# EAGLE design snowflake-hw-v0.0.1 (EAGLE 9.6.2)
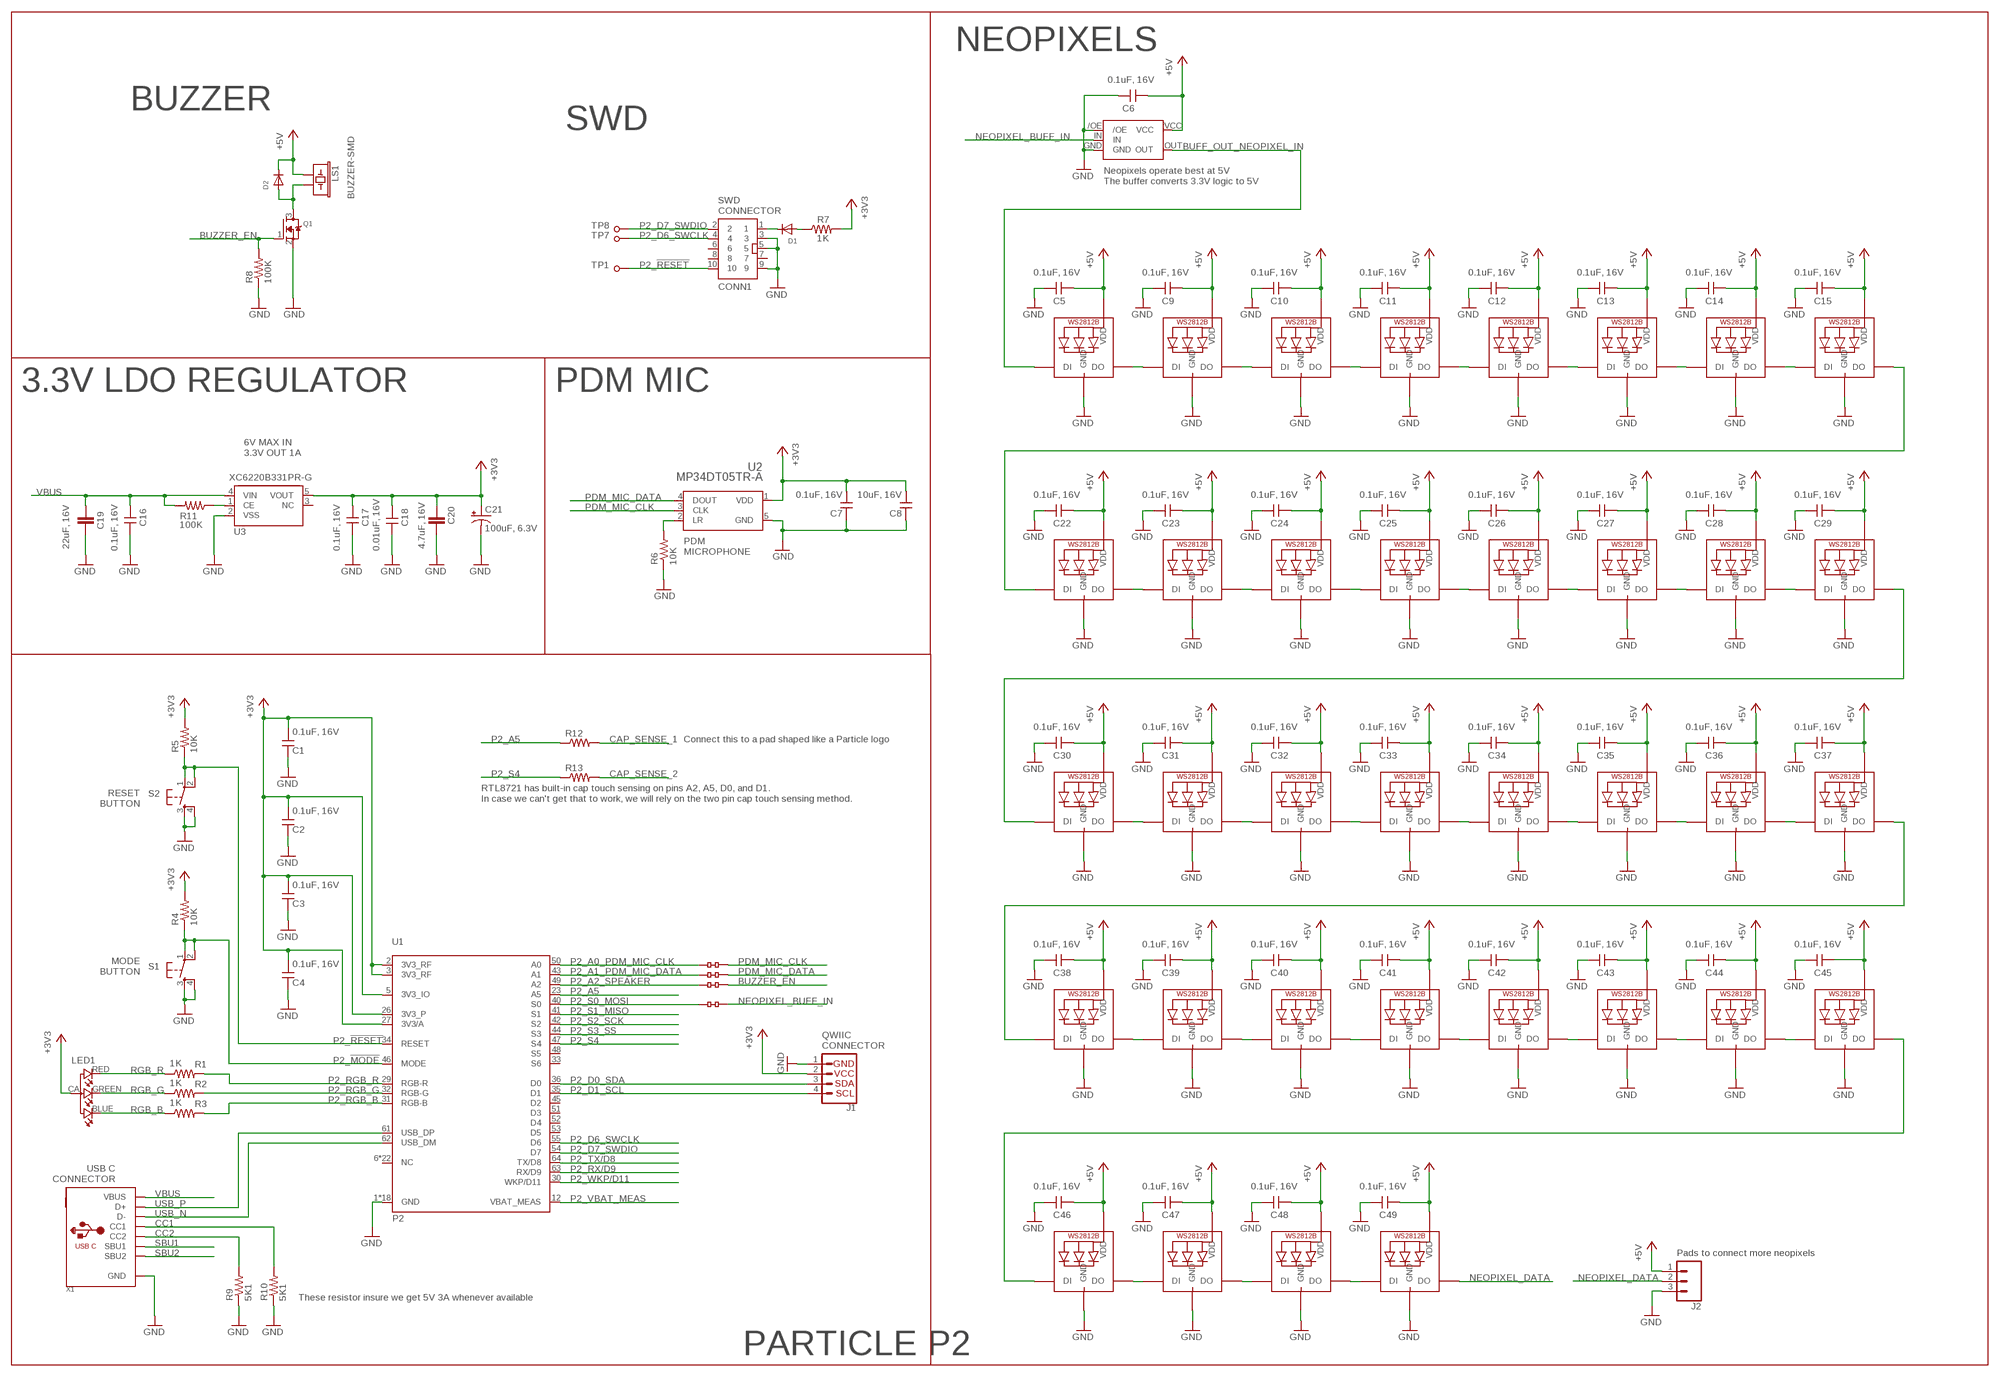
[diagram p0: schematic, sheet 1]

## Parts
C1  0.1uF, 16V  CAP_0.1UF_16V_0603  [C0603_P]
C2  0.1uF, 16V  CAP_0.1UF_16V_0603  [C0603_P]
C3  0.1uF, 16V  CAP_0.1UF_16V_0603  [C0603_P]
C4  0.1uF, 16V  CAP_0.1UF_16V_0603  [C0603_P]
C5  0.1uF, 16V  CAP_0.1UF_16V_0603  [C0603_P]
C6  0.1uF, 16V  CAP_0.1UF_16V_0603  [C0603_P]
C7  0.1uF, 16V  CAP_0.1UF_16V_0603  [C0603_P]
C8  10uF, 16V  CAP_10UF_16V_0603  [C0603_P]
C9  0.1uF, 16V  CAP_0.1UF_16V_0603  [C0603_P]
C10  0.1uF, 16V  CAP_0.1UF_16V_0603  [C0603_P]
C11  0.1uF, 16V  CAP_0.1UF_16V_0603  [C0603_P]
C12  0.1uF, 16V  CAP_0.1UF_16V_0603  [C0603_P]
C13  0.1uF, 16V  CAP_0.1UF_16V_0603  [C0603_P]
C14  0.1uF, 16V  CAP_0.1UF_16V_0603  [C0603_P]
C15  0.1uF, 16V  CAP_0.1UF_16V_0603  [C0603_P]
C16  0.1uF, 16V  CAP_0.1UF_16V_0603  [C0603_P]
C17  0.1uF, 16V  CAP_0.1UF_16V_0603  [C0603_P]
C18  0.01uF, 16V  CAP_0.01UF_25V_0603  [C0603_P]
C19  22uF, 16V  C-EUC0805  [C0805]
C20  4.7uF, 16V  C-EUC0805  [C0805]
C21  100uF, 6.3V  CPOL-USC  [PANASONIC_C]
C22  0.1uF, 16V  CAP_0.1UF_16V_0603  [C0603_P]
C23  0.1uF, 16V  CAP_0.1UF_16V_0603  [C0603_P]
C24  0.1uF, 16V  CAP_0.1UF_16V_0603  [C0603_P]
C25  0.1uF, 16V  CAP_0.1UF_16V_0603  [C0603_P]
C26  0.1uF, 16V  CAP_0.1UF_16V_0603  [C0603_P]
C27  0.1uF, 16V  CAP_0.1UF_16V_0603  [C0603_P]
C28  0.1uF, 16V  CAP_0.1UF_16V_0603  [C0603_P]
C29  0.1uF, 16V  CAP_0.1UF_16V_0603  [C0603_P]
C30  0.1uF, 16V  CAP_0.1UF_16V_0603  [C0603_P]
C31  0.1uF, 16V  CAP_0.1UF_16V_0603  [C0603_P]
C32  0.1uF, 16V  CAP_0.1UF_16V_0603  [C0603_P]
C33  0.1uF, 16V  CAP_0.1UF_16V_0603  [C0603_P]
C34  0.1uF, 16V  CAP_0.1UF_16V_0603  [C0603_P]
C35  0.1uF, 16V  CAP_0.1UF_16V_0603  [C0603_P]
C36  0.1uF, 16V  CAP_0.1UF_16V_0603  [C0603_P]
C37  0.1uF, 16V  CAP_0.1UF_16V_0603  [C0603_P]
C38  0.1uF, 16V  CAP_0.1UF_16V_0603  [C0603_P]
C39  0.1uF, 16V  CAP_0.1UF_16V_0603  [C0603_P]
C40  0.1uF, 16V  CAP_0.1UF_16V_0603  [C0603_P]
C41  0.1uF, 16V  CAP_0.1UF_16V_0603  [C0603_P]
C42  0.1uF, 16V  CAP_0.1UF_16V_0603  [C0603_P]
C43  0.1uF, 16V  CAP_0.1UF_16V_0603  [C0603_P]
C44  0.1uF, 16V  CAP_0.1UF_16V_0603  [C0603_P]
C45  0.1uF, 16V  CAP_0.1UF_16V_0603  [C0603_P]
C46  0.1uF, 16V  CAP_0.1UF_16V_0603  [C0603_P]
C47  0.1uF, 16V  CAP_0.1UF_16V_0603  [C0603_P]
C48  0.1uF, 16V  CAP_0.1UF_16V_0603  [C0603_P]
C49  0.1uF, 16V  CAP_0.1UF_16V_0603  [C0603_P]
CONN1  CONN5X2  [CONN5X2_1.27]
D1  DIODESOD-123  [SOD-123]
D2  DIODESOD-123  [SOD-123]
J1  QWIIC_CONNECTORJS-1MM  [1X04_1MM_RA]
J2  CONN_031X03_NO_SILK  [1X03_NO_SILK]
LED1  RGB-LED-CLMVB-FKARGB  [PLCC4-2MM-RGB]
LED2  WS2812B_SK6812E  [NEO3535_REVERSE]
LED3  WS2812B_SK6812E  [NEO3535_REVERSE]
LED4  WS2812B_SK6812E  [NEO3535_REVERSE]
LED5  WS2812B_SK6812E  [NEO3535_REVERSE]
LED6  WS2812B_SK6812E  [NEO3535_REVERSE]
LED7  WS2812B_SK6812E  [NEO3535_REVERSE]
LED8  WS2812B_SK6812E  [NEO3535_REVERSE]
LED9  WS2812B_SK6812E  [NEO3535_REVERSE]
LED10  WS2812B_SK6812E  [NEO3535_REVERSE]
LED11  WS2812B_SK6812E  [NEO3535_REVERSE]
LED12  WS2812B_SK6812E  [NEO3535_REVERSE]
LED13  WS2812B_SK6812E  [NEO3535_REVERSE]
LED14  WS2812B_SK6812E  [NEO3535_REVERSE]
LED15  WS2812B_SK6812E  [NEO3535_REVERSE]
LED16  WS2812B_SK6812E  [NEO3535_REVERSE]
LED17  WS2812B_SK6812E  [NEO3535_REVERSE]
LED18  WS2812B_SK6812E  [NEO3535_REVERSE]
LED19  WS2812B_SK6812E  [NEO3535_REVERSE]
LED20  WS2812B_SK6812E  [NEO3535_REVERSE]
LED21  WS2812B_SK6812E  [NEO3535_REVERSE]
LED22  WS2812B_SK6812E  [NEO3535_REVERSE]
LED23  WS2812B_SK6812E  [NEO3535_REVERSE]
LED24  WS2812B_SK6812E  [NEO3535_REVERSE]
LED25  WS2812B_SK6812E  [NEO3535_REVERSE]
LED26  WS2812B_SK6812E  [NEO3535_REVERSE]
LED27  WS2812B_SK6812E  [NEO3535_REVERSE]
LED28  WS2812B_SK6812E  [NEO3535_REVERSE]
LED29  WS2812B_SK6812E  [NEO3535_REVERSE]
LED30  WS2812B_SK6812E  [NEO3535_REVERSE]
LED31  WS2812B_SK6812E  [NEO3535_REVERSE]
LED32  WS2812B_SK6812E  [NEO3535_REVERSE]
LED33  WS2812B_SK6812E  [NEO3535_REVERSE]
LED34  WS2812B_SK6812E  [NEO3535_REVERSE]
LED35  WS2812B_SK6812E  [NEO3535_REVERSE]
LED36  WS2812B_SK6812E  [NEO3535_REVERSE]
LED37  WS2812B_SK6812E  [NEO3535_REVERSE]
LS1  BUZZER-SMD  [BUZZER-CCV]
Q1  MOSFET-NREFLOW  [SOT23]
R1  1K  RES_1K_0603  [R0603_P]
R2  1K  RES_1K_0603  [R0603_P]
R3  1K  RES_1K_0603  [R0603_P]
R4  10K  RES_10K_0603  [R0603_P]
R5  10K  RES_10K_0603  [R0603_P]
R6  10K  RES_10K_0603  [R0603_P]
R7  1K  RES_1K_0603  [R0603_P]
R8  100K  RES_100K_0603  [R0603_P]
R9  5K1  RES_0603  [R0603_P]
R10  5K1  RES_0603  [R0603_P]
R11  100K  RES_100K_0603  [R0603_P]
R12  RES_0603  [R0603_P]
R13  RES_0603  [R0603_P]
S1  TAC_SWITCHSMD  [TACTILE_SWITCH_SMD]
S2  TAC_SWITCHSMD  [TACTILE_SWITCH_SMD]
TP1  TP-1.5MM  [TP]
TP7  TP-1.5MM  [TP]
TP8  TP-1.5MM  [TP]
U1  P2  [P2]
U2  MP34DT05TR-A  [MP34DT05TR-A_STM]
U3  XC6220B331PR-G  XC6220B331PR-GSOT-89-5_TOR-M  [SOT-89-5_TOR-M]
U$1  NL17SZ125SOT553  [SOT-553]
U$2  JMP_0603_NC  [JMP_0603_NC]
U$3  JMP_0603_NC  [JMP_0603_NC]
U$4  JMP_0603_NC  [JMP_0603_NC]
U$15  JMP_0603_NC  [JMP_0603_NC]
X1  USB_C  [USB_C_CUSB31-CFM2AX-01-X]

## Nets
+3V3: C1.1 C2.1 C3.1 C4.1 C7.1 C8.1 C17.2 C18.1 C20.1 C21.+ J1.2(VCC) LED1.CA R4.2 R5.2 R7.2 U1.2(3V3_RF) U1.3(3V3_RF) U1.5(3V3_IO) U1.26(3V3_P) U1.27(3V3/A) U2.1(VDD) U3.5(VOUT)
+5V: C5.2 C6.2 C9.2 C10.2 C11.2 C12.2 C13.2 C14.2 C15.2 C22.2 C23.2 C24.2 C25.2 C26.2 C27.2 C28.2 C29.2 C30.2 C31.2 C32.2 C33.2 C34.2 C35.2 C36.2 C37.2 C38.2 C39.2 C40.2 C41.2 C42.2 C43.2 C44.2 C45.2 C46.2 C47.2 C48.2 C49.2 D2.C J2.1 LED2.1-VDD(VDD) LED3.1-VDD(VDD) LED4.1-VDD(VDD) LED5.1-VDD(VDD) LED6.1-VDD(VDD) LED7.1-VDD(VDD) LED8.1-VDD(VDD) LED9.1-VDD(VDD) LED10.1-VDD(VDD) LED11.1-VDD(VDD) LED12.1-VDD(VDD) LED13.1-VDD(VDD) LED14.1-VDD(VDD) LED15.1-VDD(VDD) LED16.1-VDD(VDD) LED17.1-VDD(VDD) LED18.1-VDD(VDD) LED19.1-VDD(VDD) LED20.1-VDD(VDD) LED21.1-VDD(VDD) LED22.1-VDD(VDD) LED23.1-VDD(VDD) LED24.1-VDD(VDD) LED25.1-VDD(VDD) LED26.1-VDD(VDD) LED27.1-VDD(VDD) LED28.1-VDD(VDD) LED29.1-VDD(VDD) LED30.1-VDD(VDD) LED31.1-VDD(VDD) LED32.1-VDD(VDD) LED33.1-VDD(VDD) LED34.1-VDD(VDD) LED35.1-VDD(VDD) LED36.1-VDD(VDD) LED37.1-VDD(VDD) LS1.+ U$1.VCC
BUFF_OUT_NEOPIXEL_IN: LED2.4-DIN(DI) U$1.OUT
BUZZER_EN: Q1.1(G) R8.2 U$2.2
CAP_SENSE_1: R12.2
CAP_SENSE_2: R13.2
CC1: R10.2 X1.A5(CC1)
CC2: R9.2 X1.B5(CC2)
GND: C1.2 C2.2 C3.2 C4.2 C5.1 C6.1 C7.2 C8.2 C9.1 C10.1 C11.1 C12.1 C13.1 C14.1 C15.1 C16.1 C17.1 C18.2 C19.2 C20.2 C21.- C22.1 C23.1 C24.1 C25.1 C26.1 C27.1 C28.1 C29.1 C30.1 C31.1 C32.1 C33.1 C34.1 C35.1 C36.1 C37.1 C38.1 C39.1 C40.1 C41.1 C42.1 C43.1 C44.1 C45.1 C46.1 C47.1 C48.1 C49.1 CONN1.3 CONN1.5 CONN1.9 J1.1(GND) J2.3 LED2.3-GND(GND) LED3.3-GND(GND) LED4.3-GND(GND) LED5.3-GND(GND) LED6.3-GND(GND) LED7.3-GND(GND) LED8.3-GND(GND) LED9.3-GND(GND) LED10.3-GND(GND) LED11.3-GND(GND) LED12.3-GND(GND) LED13.3-GND(GND) LED14.3-GND(GND) LED15.3-GND(GND) LED16.3-GND(GND) LED17.3-GND(GND) LED18.3-GND(GND) LED19.3-GND(GND) LED20.3-GND(GND) LED21.3-GND(GND) LED22.3-GND(GND) LED23.3-GND(GND) LED24.3-GND(GND) LED25.3-GND(GND) LED26.3-GND(GND) LED27.3-GND(GND) LED28.3-GND(GND) LED29.3-GND(GND) LED30.3-GND(GND) LED31.3-GND(GND) LED32.3-GND(GND) LED33.3-GND(GND) LED34.3-GND(GND) LED35.3-GND(GND) LED36.3-GND(GND) LED37.3-GND(GND) Q1.2(S) R6.1 R8.1 R9.1 R10.1 S1.3 S1.4 S2.3 S2.4 U1.1(GND) U1.4(GND) U1.13(GND) U1.15(GND) U1.25(GND) U1.28(GND) U1.37(GND) U1.39(GND) U1.59(GND) U1.65(GND) U1.66(GND) U1.67(GND) U1.68(GND) U1.69(GND) U1.70(GND) U1.71(GND) U1.72(GND) U1.73(GND) U2.5(GND) U3.2(VSS) U$1./OE U$1.GND X1.A1B12(GND) X1.B1A12(GND)
N$1: R6.2 U2.2(LR)
N$2: LED2.2-DOUT(DO) LED3.4-DIN(DI)
N$3: LED3.2-DOUT(DO) LED4.4-DIN(DI)
N$4: LED4.2-DOUT(DO) LED5.4-DIN(DI)
N$5: LED5.2-DOUT(DO) LED6.4-DIN(DI)
N$6: LED6.2-DOUT(DO) LED7.4-DIN(DI)
N$7: LED7.2-DOUT(DO) LED8.4-DIN(DI)
N$8: LED8.2-DOUT(DO) LED9.4-DIN(DI)
N$9: D2.A LS1.- Q1.3(D)
N$10: R11.1 U3.1(CE)
N$11: LED10.2-DOUT(DO) LED11.4-DIN(DI)
N$12: LED11.2-DOUT(DO) LED12.4-DIN(DI)
N$13: LED12.2-DOUT(DO) LED13.4-DIN(DI)
N$14: LED13.2-DOUT(DO) LED14.4-DIN(DI)
N$15: LED14.2-DOUT(DO) LED15.4-DIN(DI)
N$16: LED15.2-DOUT(DO) LED16.4-DIN(DI)
N$17: CONN1.1 D1.C
N$18: D1.A R7.1
N$19: LED16.2-DOUT(DO) LED17.4-DIN(DI)
N$20: LED9.2-DOUT(DO) LED10.4-DIN(DI)
N$21: LED24.2-DOUT(DO) LED25.4-DIN(DI)
N$22: LED23.2-DOUT(DO) LED24.4-DIN(DI)
N$23: LED22.2-DOUT(DO) LED23.4-DIN(DI)
N$24: LED21.2-DOUT(DO) LED22.4-DIN(DI)
N$25: LED20.2-DOUT(DO) LED21.4-DIN(DI)
N$26: LED19.2-DOUT(DO) LED20.4-DIN(DI)
N$27: LED18.2-DOUT(DO) LED19.4-DIN(DI)
N$28: LED25.2-DOUT(DO) LED26.4-DIN(DI)
N$29: LED26.2-DOUT(DO) LED27.4-DIN(DI)
N$30: LED27.2-DOUT(DO) LED28.4-DIN(DI)
N$31: LED28.2-DOUT(DO) LED29.4-DIN(DI)
N$32: LED29.2-DOUT(DO) LED30.4-DIN(DI)
N$33: LED30.2-DOUT(DO) LED31.4-DIN(DI)
N$34: LED31.2-DOUT(DO) LED32.4-DIN(DI)
N$35: LED32.2-DOUT(DO) LED33.4-DIN(DI)
N$36: LED17.2-DOUT(DO) LED18.4-DIN(DI)
N$37: LED34.2-DOUT(DO) LED35.4-DIN(DI)
N$38: LED35.2-DOUT(DO) LED36.4-DIN(DI)
N$39: LED36.2-DOUT(DO) LED37.4-DIN(DI)
N$40: LED33.2-DOUT(DO) LED34.4-DIN(DI)
NEOPIXEL_BUFF_IN: U$1.IN U$15.2
NEOPIXEL_DATA: J2.2 LED37.2-DOUT(DO)
P2_!MODE: R4.1 S1.1 S1.2 U1.46(MODE)
P2_!RESET: CONN1.10 R5.1 S2.1 S2.2 TP1.TP U1.34(RESET)
P2_A0_PDM_MIC_CLK: U1.50(A0) U$4.1
P2_A1_PDM_MIC_DATA: U1.43(A1) U$3.1
P2_A2_SPEAKER: U1.49(A2) U$2.1
P2_A5: R12.1 U1.23(A5)
P2_D0_SDA: J1.3(SDA) U1.36(D0)
P2_D1_SCL: J1.4(SCL) U1.35(D1)
P2_D6_SWCLK: CONN1.4 TP7.TP U1.55(D6)
P2_D7_SWDIO: CONN1.2 TP8.TP U1.54(D7)
P2_RGB_B: R3.2 U1.31(RGB-B)
P2_RGB_G: R2.2 U1.32(RGB-G)
P2_RGB_R: R1.2 U1.29(RGB-R)
P2_RX/D9: U1.63(RX/D9)
P2_S0_MOSI: U1.40(S0) U$15.1
P2_S1_MISO: U1.41(S1)
P2_S2_SCK: U1.42(S2)
P2_S3_SS: U1.44(S3)
P2_S4: R13.1 U1.47(S4)
P2_TX/D8: U1.64(TX/D8)
P2_VBAT_MEAS: U1.12(VBAT_MEAS)
P2_WKP/D11: U1.30(WKP/D11)
PDM_MIC_CLK: U2.3(CLK) U$4.2
PDM_MIC_DATA: U2.4(DOUT) U$3.2
RGB_B: LED1.BLUE R3.1
RGB_G: LED1.GREEN R2.1
RGB_R: LED1.RED R1.1
SBU1: X1.A8(SBU1)
SBU2: X1.B8(SBU2)
USB_N: U1.62(USB_DM) X1.A7(D-) X1.B7(D-)
USB_P: U1.61(USB_DP) X1.A6(D+) X1.B6(D+)
VBUS: C16.2 C19.1 R11.2 U3.4(VIN) X1.A4B9(VBUS) X1.B4A9(VBUS)
Unconnected: CONN1.6 CONN1.7 CONN1.8 U1.6(NC) U1.7(NC) U1.8(NC) U1.9(NC) U1.10(NC) U1.11(NC) U1.14(NC) U1.16(NC) U1.17(NC) U1.18(NC) U1.19(NC) U1.20(NC) U1.21(NC) U1.22(NC) U1.24(NC) U1.33(S6) U1.38(NC) U1.45(D2) U1.48(S5) U1.51(D3) U1.52(D4) U1.53(D5) U1.56(NC) U1.57(NC) U1.58(NC) U1.60(NC) U1.74(NC) U1.75(NC) U3.3(NC)

## Notes on the sheet
- NEOPIXELS
- BUZZER
- SWD
- Neopixels operate best at 5V
  The buffer converts 3.3V logic to 5V
- SWD
  CONNECTOR
- 3.3V LDO REGULATOR | PDM MIC
- 6V MAX IN
  3.3V OUT 1A
- PDM
  MICROPHONE
- Connect this to a pad shaped like a Particle logo
- RTL8721 has built-in cap touch sensing on pins A2, A5, D0, and D1. 
  In case we can't get that to work, we will rely on the two pin cap touch sensing method.
- RESET
  BUTTON
- MODE
  BUTTON
- QWIIC
  CONNECTOR
- USB C
  CONNECTOR
- Pads to connect more neopixels
- These resistor insure we get 5V 3A whenever available
- PARTICLE P2

## Library data of the parts
C1-C7 C9-C17 C22-C49 = particle-studios:CAP_: Particle Capacitors; DESP: CAP CER 0.1UF 16V X7R 0603; MFG: FENGHUA; MPN: 0603B104K160NT; PPN: PT-200082
C8 = particle-studios:CAP_: Particle Capacitors; DESP: CAP CER 10UF 16V X7R 0603; MFG: FENGHUA; MPN: 0603X106M160NT; PPN: PT-200139
C18 = particle-studios:CAP_: Particle Capacitors; DESP: CAP CER 0.01UF 16V X7R 0603; MFG: YAGEO; MPN: CC0603KRX7R9BB103; PPN: PT-200456
C19 C20 = rcl:C-EU: CAPACITOR, European symbol; SPICEPREFIX: C
C21 = rcl:CPOL-US: POLARIZED CAPACITOR, American symbol; SPICEPREFIX: C
CONN1 = particle-studios:CONN5X2: 5x2 pin JTAG connector for Particle mesh dev kits
D1 D2 = particle-studios:DIODE: Diode SMADIODE - SMA Surface Mount Package 20V 1A Schottky Diode Digikey: 641-1014-6-ND DO-1N4148 - Through Hole Small Current Diode SOD-123 20V 1 A (.5mV Vf) Schottky Diode - Digikey: MBRX120TPMSCT-ND SOD-323 10V 570mA (.38mV Vf, 3ns) Schottky Diode - Digikey: ZLLS410CT-ND SOD-523 30V 30mA Schottky Diode (RB751S-40TE61) - Digikey: RB751S-40TE61CT-ND SOT23-R/W - SOT23 Package (R = Solder Paste/Reflow Ovens, W = Hand-Soldering) BAT54Film 40V 300mA - Digikey: 497-7162-1-ND
J1 = SparkFun-Connectors:QWIIC_CONNECTOR: SparkFun I2C Standard Qwiic Connector An SMD 1mm pitch JST connector makes it easy and quick (get it? Qwiic?) to connect I2C devices to each other. The Qwiic system <http://www.sparkfun.com/qwiic> enables fast and solderless connection between popular platforms and various sensors and actuators. We carry 200mm <https://www.sparkfun.com/products/14204>, 100mm <https://www.sparkfun.com/products/14205>, 50mm <https://www.sparkfun.com/products/14206>, and breadboard friendly <https://www.sparkfun.com/products/14207> Qwiic cables. We also offer 10 pcs strips <https://www.sparkfun.com/products/14323> the SMD connectors.
J2 = particle-studios:CONN_03: Multi connection point. Often used as Generic Header-pin footprint for 0.1 inch spaced/style header connections On any of the 0.1 inch spaced packages, you can populate with these: Break Away Headers - Straight <https://www.sparkfun.com/products/116> (PRT-00116) Break Away Male Headers - Right Angle <https://www.sparkfun.com/products/553> (PRT-00553) Female Headers <https://www.sparkfun.com/products/115> (PRT-00115) Break Away Headers - Machine Pin <https://www.sparkfun.com/products/117> (PRT-00117) Break Away Female Headers - Swiss Machine Pin <https://www.sparkfun.com/products/743> (PRT-00743) Stackable Header - 3 Pin (Female, 0.1") <https://www.sparkfun.com/products/13875> (PRT-13875) For SCREWTERMINALS and SPRING TERMINALS visit here: Screw Terimnals on SparkFun.com <https://www.sparkfun.com/search/results?term=Screw+Terminals> (5mm/3.5mm/2.54mm spacing) This device is also useful as a general connection point to wire up your design to another part of your project. Our various solder wires solder well into these plated through hole pads. Hook-Up Wire - Assortment (Stranded, 22 AWG) <https://www.sparkfun.com/products/11375> (PRT-11375) Hook-Up Wire - Assortment (Solid Core, 22 AWG) <https://www.sparkfun.com/products/11367> (PRT-11367) View the entire wire category on our website here <https://www.sparkfun.com/categories/141> Special notes: Molex polarized connector foot print use with SKU : PRT-08232 with associated crimp pins and housings.
LED1 = particle-studios:RGB-LED-CLMVB-FKA: CREE CLMVB-FKA RGB LED 2mm x 2mm
LED2-LED37 = microbuilder:WS2812B
LS1 = SparkFun-Electromechanical:BUZZER: Buzzer Small round buzzers that operate around the audible 2kHz range. You can use these as speakers to create simple music or user interfaces. Variant Overview: PTH - Mini Speaker - PC Mount 12mm 2.048kHz <https://www.sparkfun.com/products/7950> PTH_KIT - Mini Speaker - PC Mount 12mm 2.048kHz <https://www.sparkfun.com/products/7950> KIT simplifies soldering by adding stop mask to one side of the pads. PTH_NO_SILK - Mini Speaker - PC Mount 12mm 2.048kHz <https://www.sparkfun.com/products/7950> No silkscreen indicator of buzzer outline. PTH_KIT_NO_SILK - Mini Speaker - PC Mount 12mm 2.048kHz <https://www.sparkfun.com/products/7950> KIT package w/o silkscreen SMD - Buzzer Audio Magnetic (CCV-084B16) SMD buzzer used on, e.g. the LilyPad Buzzer <https://www.sparkfun.com/products/8463> and RFID USB Reader <https://www.sparkfun.com/products/9963>. SMD_KIT - Buzzer Audio Magnetic (CCV-084B16) SMD Buzzer with elongated pins to make soldering easier. Used on the SparkFun Simon Says - Surface Mount Soldering Kit <https://www.sparkfun.com/products/10935>.; PROD_ID: COMP-08568
Q1 = adafruit:MOSFET-N: N-Channel Mosfet 2N7002E - 60V 260mA SOT23 [Digikey: 2N7002ET1GOSTR-ND] - REEL BSH103 - 30V 850mA SOT23 [Digikey: 568-5013-1-ND]
R1-R3 R7 = particle-studios:RES_: Particle Resistors; DESP: RES SMD 1K OHM 1% 1/10W 0603; MFG: FENGHUA; MPN: RC-03K102FT; PPN: PT-200135
R4-R6 = particle-studios:RES_: Particle Resistors; DESP: RES SMD 10K OHM 1% 1/10W 0603; MFG: YAGEO; MPN: RC0603FR-0710KL; PPN: PT-200477
R8 R11 = particle-studios:RES_: Particle Resistors; DESP: RES SMD 100K OHM 1% 1/10W 0603
R9 R10 R12 R13 = particle-studios:RES_: Particle Resistors
S1 S2 = particle-studios:TAC_SWITCH: SMD Tactiile Switch
TP1 TP7 TP8 = particle-studios:TP-1.5MM
U1 = particle-studios:P2: Particle P2
U2 = particle-studios:MP34DT05TR-A; COPYRIGHT: Copyright (C) 2023 Ultra Librarian. All rights reserved.; DIGIKEY_PART_NUMBER_1: MP34DT05TR-A-ND; DIGIKEY_PART_NUMBER_2: 497-17809-1-ND; DIGIKEY_PART_NUMBER_3: 497-17809-2-ND; DIGIKEY_PART_NUMBER_4: 497-17809-6-ND; MANUFACTURER_PART_NUMBER: MP34DT05TR-A; MFR_NAME: STMicroelectronics
U3 = particle-studios:XC6220B331PR-G; COPYRIGHT: Copyright (C) 2022 Ultra Librarian. All rights reserved.; DIGI-KEY_PART_NUMBER_1: 893-1128-1-ND; DIGI-KEY_PART_NUMBER_2: 893-1128-2-ND; DIGI-KEY_PART_NUMBER_3: 893-1128-2-NDL; DIGI-KEY_PART_NUMBER_4: 893-1128-6-ND; MANUFACTURER_PART_NUMBER: XC6220B331PR-G; MFR_NAME: Torex Semiconductor
U$1 = Particle:NL17SZ125
U$2-U$4 U$15 = particle-studios:JMP_0603_NC
X1 = microbuilder:USB_C: USB Type-C USB 2.0 Connector

## Board
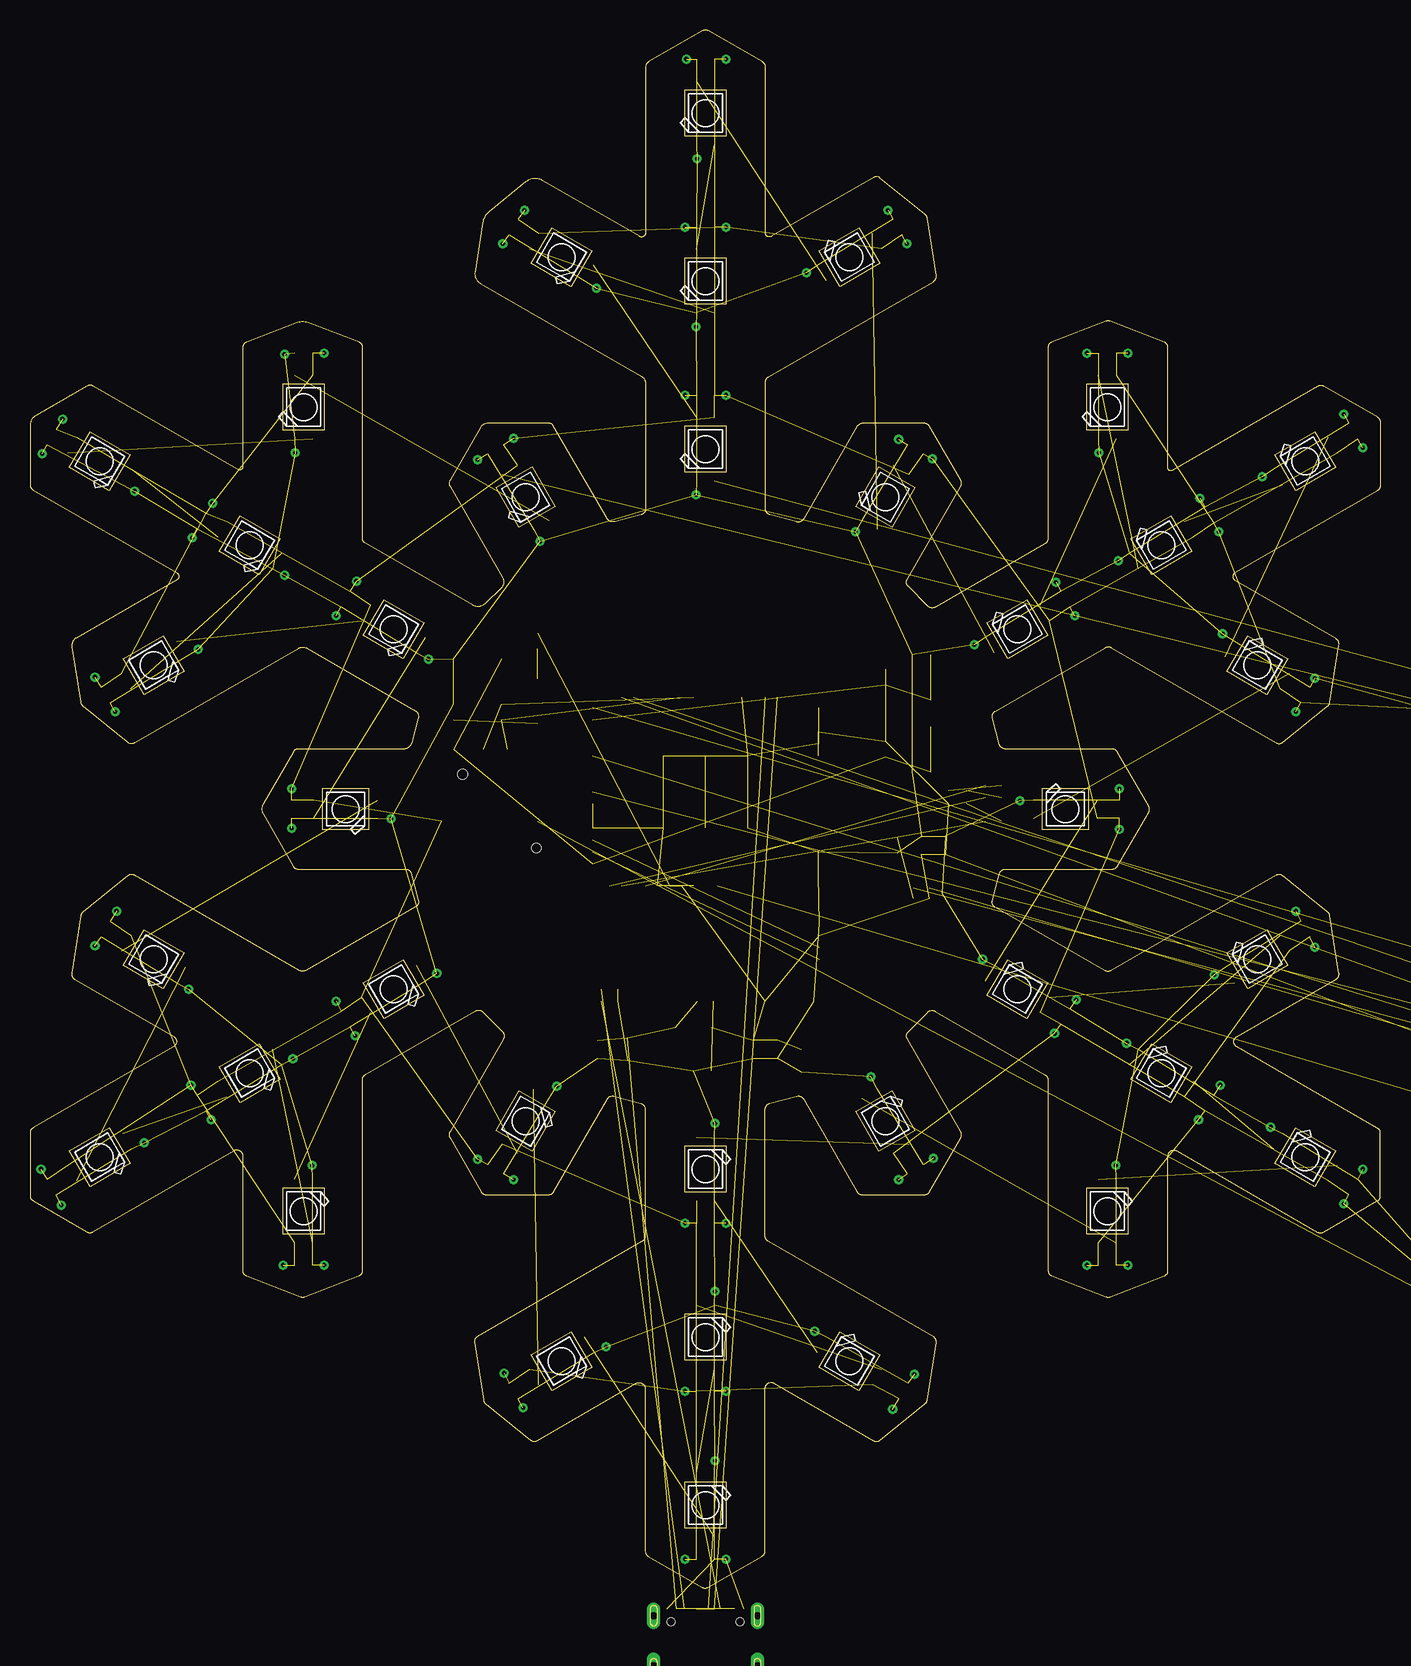
[diagram p1: board, top side]
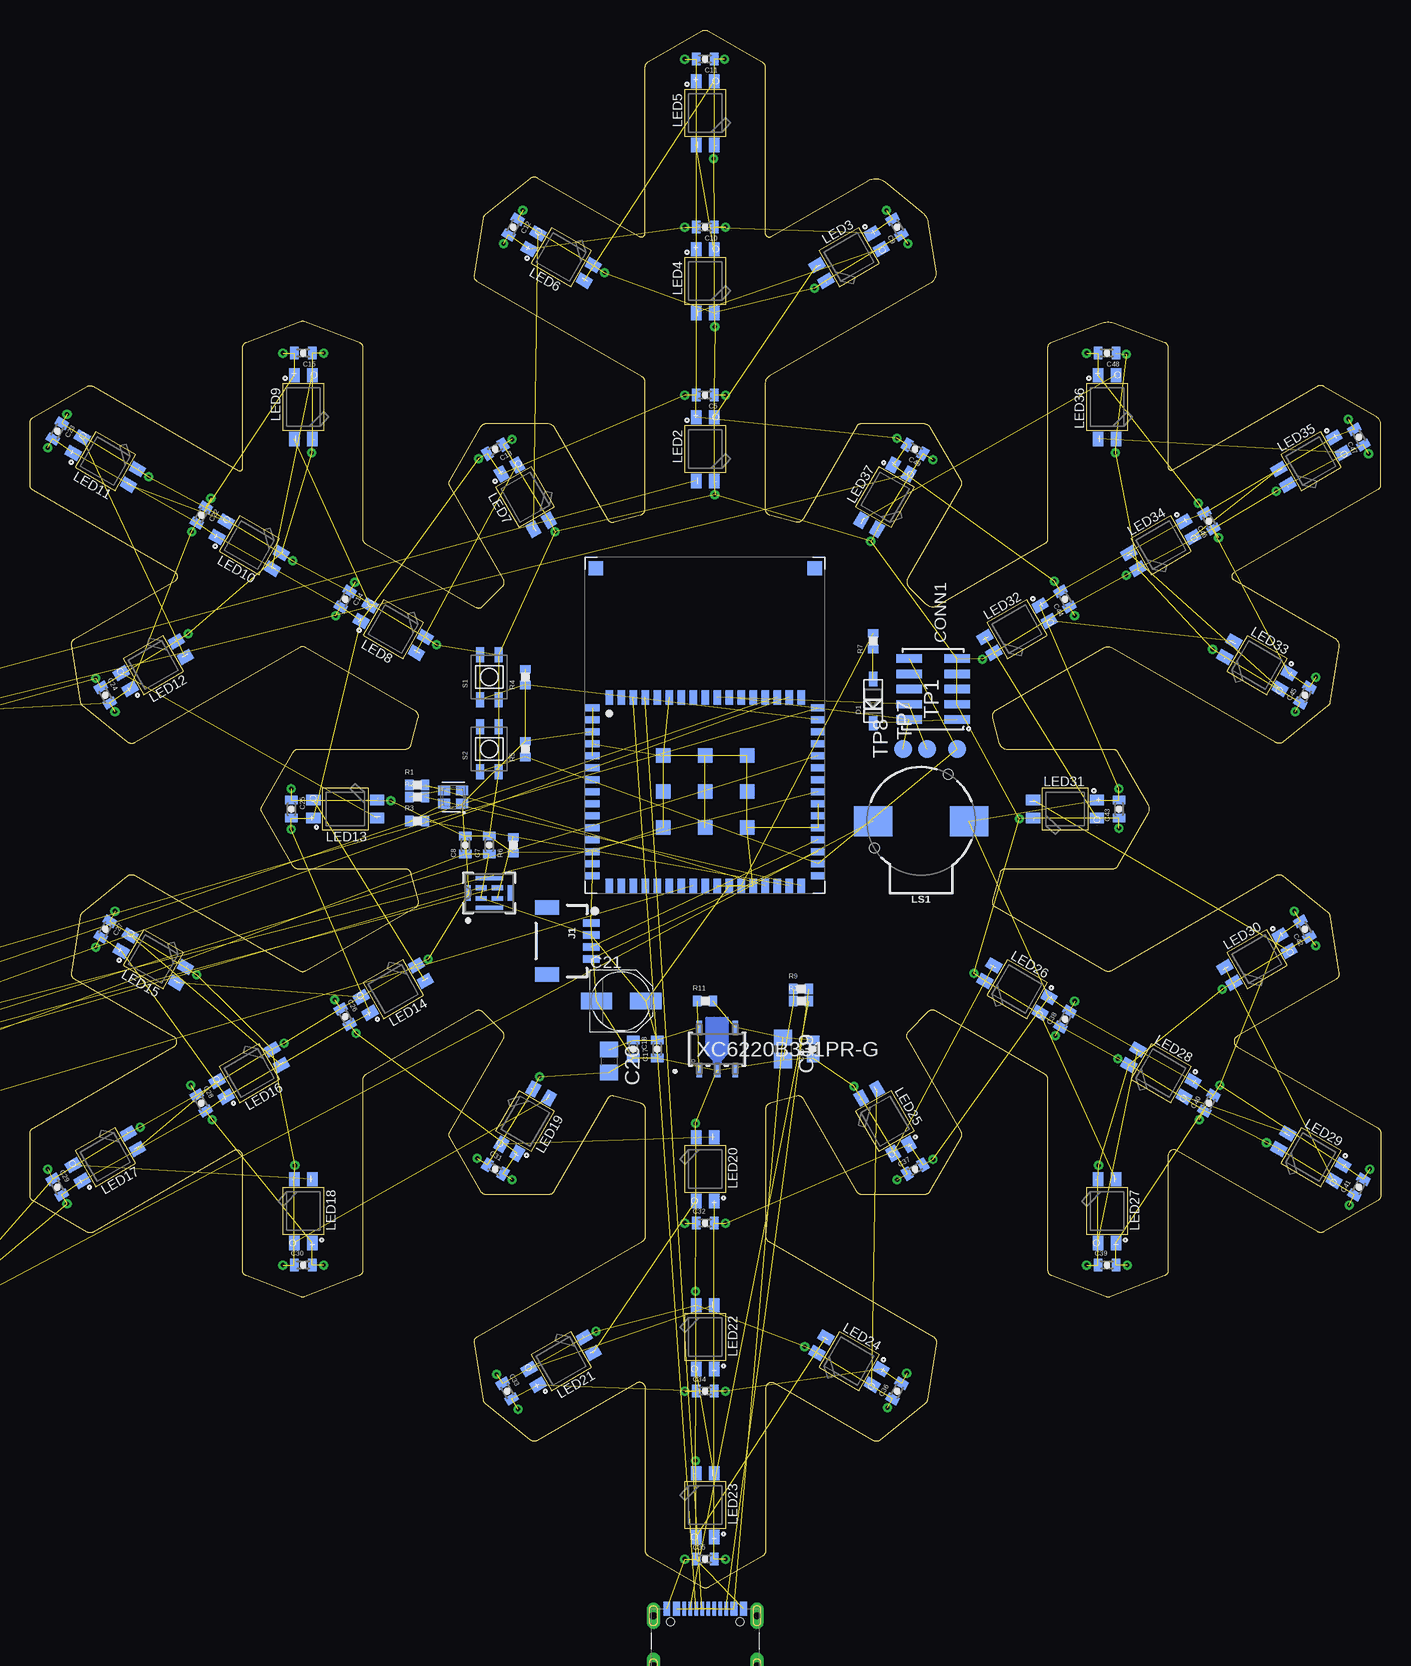
[diagram p2: board, bottom side, seen from below]

Size 112.6 x 129.84 mm. Coordinates in mm from the lower left corner, seen from the top.
Outline: 39.3,83.38 37.95,82.03 arc-75 36.93,81.9 27.92,87.1 arc-60 27.73,87.42 27.73,103.42 arc69 27.46,103.81 23.31,105.41 arc42 22.15,105.41 18.04,103.83 arc69 17.73,103.37 17.73,93.42 arc-120 17.35,93.2 5.28,100.17 arc60 4.75,100.17 0.46,97.69 arc60 0.01,96.92 0.01,91.92 arc60 0.24,91.53 12.25,84.6 arc-120 12.25,84.03 3.84,79.17 arc69 3.5,78.45 4.23,73.82 arc42 4.39,73.52 8.1,70.53 arc69 8.78,70.48 22.38,78.33 arc-60 23.11,78.33 32.1,73.14 arc-75 32.37,72.5 31.81,70.43 arc-75 31.15,69.92 22.31,69.92 arc60 21.96,69.72 19.42,65.31 arc60 19.42,64.53 21.95,60.14 arc60 22.33,59.92 31.31,59.92 arc-75 31.76,59.58 32.37,57.33 arc-75 32.14,56.76 22.96,51.47 arc-60 22.46,51.47 8.72,59.4 arc69 8.16,59.36 4.4,56.33 arc42 4.22,56.02 3.48,51.25 arc69 3.72,50.74 11.96,45.98 arc-120 11.96,45.12 0.25,38.35 arc60 0,37.92 0,32.72 arc60 0.25,32.29 4.75,29.69 arc60 5.25,29.69 16.98,36.47 arc-120 17.73,36.03 17.73,26.48 arc69 18.05,26.01 22.55,24.28 arc42 22.91,24.28 27.41,26.01 arc69 27.73,26.48 27.73,42.38 arc-60 27.98,42.82 37.14,48.1 arc-75 37.74,48.02 39.39,46.37 arc-75 39.47,45.77 35,38.04 arc60 35,37.54 37.6,33.04 arc60 38.03,32.79 43.23,32.79 arc60 43.66,33.04 48.12,40.77 arc-75 48.69,41 50.91,40.4 arc-75 51.28,39.91 51.28,29.33 arc-60 51.03,28.89 37.29,20.96 arc69 37.05,20.45 37.79,15.68 arc42 37.97,15.37 41.73,12.34 arc69 42.29,12.3 50.53,17.06 arc-120 51.28,16.63 51.28,3.1 arc60 51.53,2.67 56.03,0.07 arc60 56.53,0.07 61.03,2.67 arc60 61.28,3.1 61.28,16.64 arc-120 62.03,17.08 70.31,12.3 arc69 70.87,12.34 74.62,15.37 arc42 74.8,15.68 75.55,20.45 arc69 75.31,20.96 61.53,28.91 arc-60 61.28,29.34 61.28,39.91 arc-75 61.65,40.39 63.91,41 arc-75 64.47,40.77 68.93,33.04 arc60 69.37,32.79 74.56,32.79 arc60 75,33.04 77.59,37.54 arc60 77.59,38.04 73.13,45.77 arc-75 73.21,46.37 74.84,48 arc-75 75.44,48.08 84.62,42.78 arc-60 84.87,42.35 84.87,26.48 arc69 85.19,26.01 89.69,24.28 arc42 90.05,24.28 94.55,26.01 arc69 94.87,26.48 94.87,36 arc-120 95.62,36.43 107.33,29.67 arc60 107.83,29.67 112.33,32.27 arc50 112.58,32.61 112.58,37.98 arc54 112.33,38.33 100.6,45.1 arc-120 100.6,45.97 108.88,50.74 arc69 109.12,51.25 108.37,56.02 arc42 108.19,56.33 104.44,59.36 arc69 103.88,59.4 90.1,51.45 arc-60 89.6,51.45 80.45,56.73 arc-75 80.22,57.3 80.83,59.55 arc-75 81.31,59.92 90.23,59.92 arc60 90.66,60.17 93.26,64.67 arc60 93.26,65.17 90.66,69.67 arc60 90.23,69.92 81.31,69.92 arc-75 80.83,70.29 80.23,72.52 arc-75 80.46,73.08 89.63,78.38 arc-60 90.13,78.38 103.88,70.44 arc69 104.44,70.49 108.19,73.52 arc42 108.37,73.83 109.12,78.59 arc69 108.88,79.1 100.5,83.94 arc-120 100.5,84.65 112.35,91.49 arc53 112.6,91.87 112.6,97.18 arc56 112.35,97.55 107.85,100.15 arc60 107.35,100.15 95.19,93.13 arc-120 94.87,93.32 94.87,103.37 arc69 94.55,103.83 90.05,105.57 arc42 89.69,105.57 85.14,103.81 arc69 84.87,103.42 84.87,87.46 arc-60 84.62,87.03 75.46,81.74 arc-75 74.86,81.82 73.21,83.47 arc-75 73.13,84.08 77.59,91.81 arc60 77.59,92.31 75,96.81 arc60 74.56,97.06 69.37,97.06 arc33 68.93,96.81 64.47,89.08 arc-75 63.91,88.85 61.68,89.45 arc-75 61.31,89.93 61.31,100.52 arc-60 61.56,100.95 75.31,108.89 arc69 75.55,109.4 74.8,114.16 arc42 74.62,114.47 70.87,117.5 arc69 70.31,117.55 61.81,112.64 arc-120 61.31,112.92 61.31,126.75 arc60 61.06,127.18 56.56,129.78 arc60 56.06,129.78 51.56,127.18 arc60 51.31,126.75 51.31,112.94 arc-120 50.79,112.64 42.73,117.29 arc69 41.33,117.18 38.27,114.72 arc42 37.73,113.78 37.09,109.67 arc69 37.53,108.75 50.98,100.98 arc-60 51.31,100.4 51.31,89.94 arc-75 50.94,89.45 48.76,88.87 arc-75 48.09,89.15 43.62,96.88 arc60 43.31,97.06 38.1,97.06 arc47 37.57,96.76 35.01,92.31 arc60 35.01,91.8 39.4,84.19 arc-75 39.3,83.38
Copper layers (1*16): Top 0.035mm / dielectric 1.5mm / Bottom 0.035mm
Design rules "default": minimum track width 6mil, minimum drill 0.35mm, track to track 6mil, track to pad 6mil, pad to pad 6mil, via to via 6mil, smd to smd 6mil, copper to edge 40mil, drill to drill 6mil, minimum pad ring 10mil, minimum via ring 8mil, stop-mask expansion 4mil, vias tented up to drill 0mil, thermal gap 10mil

### Footprints (pad centres in the part's own frame; a part is rotated, then mirrored left to right if it is on the bottom)
C0603_P = smd 0.711 x 1.041: 1 -0.749,0; 2 0.749,0
C0805 = smd 1.3 x 1.5: 1 -0.95,0; 2 0.95,0
PANASONIC_C = smd 2.6 x 1.4: + 2.05,0; - -2.05,0
CONN5X2_1.27 = smd 0.7 x 2.1: 1 -2.54,-2; 2 -2.54,2; 3 -1.27,-2; 4 -1.27,2; 5 0,-2; 6 0,2; 7 1.27,-2; 8 1.27,2; 9 2.54,-2; 10 2.54,2
SOD-123 = smd 1.2 x 0.7: A 1.85,0; C -1.85,0
1X04_1MM_RA = smd 0.6 x 1.35: 1 -1.5,0; 2 -0.5,0; 3 0.5,0; 4 1.5,0 | smd 1.2 x 2: NC1 2.8,-3.675; NC2 -2.8,-3.675
1X03_NO_SILK = drill 1.016 pad 1.88: 1 0,0; 2 2.54,0; 3 5.08,0
PLCC4-2MM-RGB = smd 1 x 0.8: BLUE -0.75,-0.55; CA 0.75,-0.55; GREEN -0.75,0.55; RED 0.75,0.55
NEO3535_REVERSE = smd 1.2 x 0.9 bottom: 1-VDD 2.65,-0.75; 2-DOUT 2.65,0.75; 3-GND -2.65,0.75; 4-DIN -2.65,-0.75
BUZZER-CCV = smd 3.2 x 2.5: + 4,0; - -4,0 | hole 0.8: -3.9,-2.25; 2.25,3.9
SOT23 = smd 1 x 1.4: 1 -0.95,-1.1; 2 0.95,-1.1; 3 0,1.1
R0603_P = smd 0.7 x 0.85: 1 -0.65,0; 2 0.65,0
TACTILE_SWITCH_SMD = smd 1.25 x 0.65: 1 -1.875,0.775; 2 1.875,0.775; 3 -1.875,-0.775; 4 1.875,-0.775
TP = smd 1.5 x 1.5: TP 0,0
P2 = smd 1.2 x 0.6: 1 -9.4,2.45; 2 -9.4,1.45; 3 -9.4,0.45; 4 -9.4,-0.55; 5 -9.4,-1.55; 6 -9.4,-2.55; 7 -9.4,-3.55; 8 -9.4,-4.55; 9 -9.4,-5.55; 10 -9.4,-6.55; 11 -9.4,-7.55; 12 -9.4,-8.55; 13 -9.4,-9.55; 14 -9.4,-10.55; 15 -9.4,-11.55; 33 9.4,-11.55; 34 9.4,-10.55; 35 9.4,-9.55; 36 9.4,-8.55; 37 9.4,-7.55; 38 9.4,-6.55; 39 9.4,-5.55; 40 9.4,-4.55; 41 9.4,-3.55; 42 9.4,-2.55; 43 9.4,-1.55; 44 9.4,-0.55; 45 9.4,0.45; 46 9.4,1.45; 47 9.4,2.45 | smd 0.6 x 1.2: 16 -8,-12.4; 17 -7,-12.4; 18 -6,-12.4; 19 -5,-12.4; 20 -4,-12.4; 21 -3,-12.4; 22 -2,-12.4; 23 -1,-12.4; 24 0,-12.4; 25 1,-12.4; 26 2,-12.4; 27 3,-12.4; 28 4,-12.4; 29 5,-12.4; 30 6,-12.4; 31 7,-12.4; 32 8,-12.4; 48 8,3.3; 49 7,3.3; 50 6,3.3; 51 5,3.3; 52 4,3.3; 53 3,3.3; 54 2,3.3; 55 1,3.3; 56 0,3.3; 57 -1,3.3; 58 -2,3.3; 59 -3,3.3; 60 -4,3.3; 61 -5,3.3; 62 -6,3.3; 63 -7,3.3; 64 -8,3.3 | smd 1.2 x 1.2: 65 -3.5,-1.55; 66 -3.5,-4.55; 67 -3.5,-7.55; 68 0,-1.55; 69 0,-4.55; 70 0,-7.55; 71 3.5,-1.55; 72 3.5,-4.55; 73 3.5,-7.55; 74 9.12,14.07; 75 -9.12,14.07
MP34DT05TR-A_STM = smd 0.406 x 0.94: 1 -0.45,0.675; 2 -0.45,-0.675; 3 0.45,-0.675; 4 0.45,0.675 | smd 1.295 x 0.356: 5 0,1.725; 6 0,-1.725 | smd 0.356 x 2.311: 7 -1.225,0; 8 1.225,0
SOT-89-5_TOR-M = smd 0.483 x 1.118: 1 -1.5,-1.803; 3 1.5,-1.803; 4 1.5,1.803; 5 -1.5,1.803 | smd 0.533 x 1.118: 2 0,-1.803
SOT-553 = smd 0.3 x 0.45: /OE -0.5,0; GND 0.5,0; IN 0,0; OUT 0.5,1.35; VCC -0.5,1.35
JMP_0603_NC = smd 0.711 x 1.041: 1 -0.749,0; 2 0.749,0
USB_C_CUSB31-CFM2AX-01-X = smd 0.575 x 1.15: A1B12 -3.2,7.355; A4B9 -2.4,7.355; B1A12 3.2,7.355; B4A9 2.4,7.355 | smd 0.275 x 1.15: A5 -1.25,7.355; A6 -0.25,7.355; A7 0.25,7.355; A8 1.25,7.355; B5 1.75,7.355; B6 0.75,7.355; B7 -0.75,7.355; B8 -1.75,7.355 | drill 0.6 pad 1 long: M1 -4.32,6.78; M2 4.32,6.78; M3 -4.32,2.6; M4 4.32,2.6 | hole 0.65: 2.89,6.28; -2.89,6.28

### Placement (x,y rotation side)
C1  207.81,32.92 90 bottom  (outside the outline)
C2  207.81,29.92 90 bottom  (outside the outline)
C3  195.81,16.92 180 bottom  (outside the outline)
C4  192.81,16.92 0 bottom  (outside the outline)
C5  56.31,99.42 180 bottom
C6  131.81,73.92 0 bottom  (outside the outline)
C7  74.31,61.92 90 bottom
C8  76.31,61.92 90 bottom
C9  40.31,113.42 120 bottom
C10  56.31,113.42 180 bottom
C11  56.31,127.42 180 bottom
C12  72.31,113.42 240 bottom
C13  73.81,94.92 210 bottom
C14  86.31,82.42 240 bottom
C15  89.81,102.92 180 bottom
C16  47.31,44.92 90 bottom
C17  60.31,44.92 90 bottom
C18  62.31,44.92 270 bottom
C19  49.81,44.92 270 bottom
C20  64.31,43.92 270 bottom
C21  63.31,48.92 0 bottom
C22  98.31,89.42 240 bottom
C23  110.31,96.42 240 bottom
C24  106.31,74.42 300 bottom
C25  90.81,64.92 270 bottom
C26  86.31,47.62 300 bottom
C27  106.31,54.92 240 bottom
C28  98.31,40.42 300 bottom
C29  110.31,33.42 300 bottom
C30  89.81,26.92 0 bottom
C31  73.81,34.92 330 bottom
C32  56.31,30.42 0 bottom
C33  72.81,16.42 300 bottom
C34  56.31,16.42 0 bottom
C35  56.31,2.42 0 bottom
C36  40.31,16.42 60 bottom
C37  38.81,34.92 30 bottom
C38  26.31,47.42 60 bottom
C39  22.81,26.92 0 bottom
C40  14.31,40.42 60 bottom
C41  1.81,33.42 60 bottom
C42  6.31,54.92 120 bottom
C43  21.81,64.92 90 bottom
C44  26.31,82.42 120 bottom
C45  6.31,74.42 60 bottom
C46  14.31,88.92 120 bottom
C47  1.81,95.92 120 bottom
C48  22.81,102.92 180 bottom
C49  38.81,94.92 150 bottom
CONN1  37.31,74.92 90 bottom
D1  42.31,73.92 90 bottom
D2  129.81,16.92 90 bottom  (outside the outline)
J1  65.81,53.92 270 bottom
J2  122.81,72.92 0 bottom  (outside the outline)
LED1  77.31,65.92 0 bottom
LED2  56.31,94.92 90 top
LED3  44.31,110.92 150 top
LED4  56.31,108.92 90 top
LED5  56.31,122.92 90 top
LED6  68.31,110.92 30 top
LED7  71.31,90.92 60 top
LED8  82.31,79.92 30 top
LED9  89.81,98.42 90 top
LED10  94.31,86.92 30 top
LED11  106.31,93.92 30 top
LED12  102.31,76.92 330 top
LED13  86.31,64.92 0 top
LED14  82.31,49.92 330 top
LED15  102.31,52.42 30 top
LED16  94.31,42.92 330 top
LED17  106.31,35.92 330 top
LED18  89.81,31.42 270 top
LED19  71.31,38.92 300 top
LED20  56.31,34.92 270 top
LED21  68.31,18.92 330 top
LED22  56.31,20.92 270 top
LED23  56.31,6.92 270 top
LED24  44.31,18.92 210 top
LED25  41.31,38.92 240 top
LED26  30.31,49.92 210 top
LED27  22.81,31.42 270 top
LED28  18.31,42.92 210 top
LED29  5.81,35.92 210 top
LED30  10.31,52.42 150 top
LED31  26.31,64.92 180 top
LED32  30.31,79.92 150 top
LED33  10.31,76.92 210 top
LED34  18.31,86.92 150 top
LED35  5.81,93.92 150 top
LED36  22.81,98.42 90 top
LED37  41.31,90.92 120 top
LS1  38.31,63.92 0 bottom
Q1  126.81,17.92 0 bottom  (outside the outline)
R1  80.31,66.92 0 bottom
R2  80.31,65.92 0 bottom
R3  80.31,63.92 0 bottom
R4  71.31,75.92 90 bottom
R5  71.31,69.92 90 bottom
R6  72.31,61.92 90 bottom
R7  42.31,78.92 90 bottom
R8  126.81,14.92 180 bottom  (outside the outline)
R9  48.31,49.92 0 bottom
R10  48.31,48.92 0 bottom
R11  56.31,48.92 0 bottom
R12  198.81,16.92 180 bottom  (outside the outline)
R13  184.81,32.92 0 bottom  (outside the outline)
S1  74.31,75.92 90 bottom
S2  74.31,69.92 90 bottom
TP1  35.31,69.92 90 bottom
TP7  37.81,69.92 90 bottom
TP8  39.81,69.92 90 bottom
U1  56.31,70.92 0 bottom
U2  74.31,57.92 90 bottom
U3  55.31,44.92 0 bottom
U$1  131.81,70.92 0 bottom  (outside the outline)
U$2  179.81,26.92 0 bottom  (outside the outline)
U$3  179.81,27.92 0 bottom  (outside the outline)
U$4  179.81,29.92 0 bottom  (outside the outline)
U$15  179.81,31.92 0 bottom  (outside the outline)
X1  56.31,-9.08 0 bottom

### Tracks (layer width: path | path; a pad name or v marks a point on that pad's centre or on a via)
+3V3  (21 unrouted)
+5V  (via drill 0.35)  (112 unrouted)
  other vias: 58.01,99.42 58.01,113.42 58.01,127.42 41.21,114.82 73.11,112.02 75.21,94.12 91.51,102.92 111.11,95.02 99.11,88.02 87.11,81.02 105.51,73.02 90.81,63.22 107.11,53.42 97.41,39.02 109.51,32.02 85.41,46.22 88.11,26.92 72.41,34.02 54.61,30.42 54.61,16.42 54.61,2.42 39.51,17.92 37.31,35.72 25.51,48.92 21.11,26.92 0.91,34.92 13.41,41.92 7.21,56.42 21.81,66.62 5.41,75.92 15.21,90.42 2.71,97.42 24.51,102.92 27.21,83.92 40.31,95.82 71.91,14.92
BUFF_OUT_NEOPIXEL_IN  (1 unrouted)
BUZZER_EN  (2 unrouted)
CC1  (1 unrouted)
CC2  (1 unrouted)
GND  (via drill 0.35)  (194 unrouted)
  other vias: 55.51,91.12 55.51,105.12 47.21,108.32 55.61,119.12 64.71,109.62 68.81,88.02 78.71,78.62 90.71,85.62 89.11,94.62 102.71,92.62 99.41,79.52 82.51,65.62 79.41,52.42 98.71,51.12 91.41,45.42 103.41,38.42 90.51,35.22 70.11,42.62 57.11,38.72 43.91,41.82 33.91,51.22 21.91,44.12 23.51,35.22 9.51,37.12 13.21,49.92 30.11,64.12 14.01,78.22 33.21,77.42 21.21,84.42 8.71,91.42 22.11,94.62 42.51,87.22 57.11,24.72 57.11,10.62 48.01,20.12 65.41,21.42 54.71,127.42 71.51,114.82 88.11,102.92 109.51,97.82 97.51,90.82 107.11,75.82 85.51,83.82 72.41,95.72 54.61,99.42 39.41,112.02 90.81,66.62 105.51,56.42 99.21,41.92 111.11,34.92 91.51,26.92 75.31,35.82 87.21,49.02 58.01,30.42 58.01,16.42 58.01,2.42 41.11,15.02 40.31,34.02 27.11,46.02 15.11,39.02 24.51,26.92 2.61,31.92 5.41,53.52 21.81,63.32 7.11,73.02 1.01,94.52 13.51,87.52 25.51,81.02 21.21,102.82 37.31,94.02 54.61,113.42 73.71,17.82
N$1  (1 unrouted)
N$2  (1 unrouted)
N$3  (1 unrouted)
N$4  (1 unrouted)
N$5  (1 unrouted)
N$6  (1 unrouted)
N$7  (1 unrouted)
N$8  (1 unrouted)
N$9  (2 unrouted)
N$10  (1 unrouted)
N$11  (1 unrouted)
N$12  (1 unrouted)
N$13  (1 unrouted)
N$14  (1 unrouted)
N$15  (1 unrouted)
N$16  (1 unrouted)
N$17  (1 unrouted)
N$18  (1 unrouted)
N$19  (1 unrouted)
N$20  (1 unrouted)
N$21  (1 unrouted)
N$22  (1 unrouted)
N$23  (1 unrouted)
N$24  (1 unrouted)
N$25  (1 unrouted)
N$26  (1 unrouted)
N$27  (1 unrouted)
N$28  (1 unrouted)
N$29  (1 unrouted)
N$30  (1 unrouted)
N$31  (1 unrouted)
N$32  (1 unrouted)
N$33  (1 unrouted)
N$34  (1 unrouted)
N$35  (1 unrouted)
N$36  (1 unrouted)
N$37  (1 unrouted)
N$38  (1 unrouted)
N$39  (1 unrouted)
N$40  (1 unrouted)
NEOPIXEL_BUFF_IN  (1 unrouted)
NEOPIXEL_DATA  (1 unrouted)
P2_!MODE  (3 unrouted)
P2_!RESET  (5 unrouted)
P2_A0_PDM_MIC_CLK  (1 unrouted)
P2_A1_PDM_MIC_DATA  (1 unrouted)
P2_A2_SPEAKER  (1 unrouted)
P2_A5  (1 unrouted)
P2_D0_SDA  (1 unrouted)
P2_D1_SCL  (1 unrouted)
P2_D6_SWCLK  (2 unrouted)
P2_D7_SWDIO  (2 unrouted)
P2_RGB_B  (1 unrouted)
P2_RGB_G  (1 unrouted)
P2_RGB_R  (1 unrouted)
P2_S0_MOSI  (1 unrouted)
P2_S4  (1 unrouted)
PDM_MIC_CLK  (1 unrouted)
PDM_MIC_DATA  (1 unrouted)
RGB_B  (1 unrouted)
RGB_G  (1 unrouted)
RGB_R  (1 unrouted)
USB_N  (2 unrouted)
USB_P  (2 unrouted)
VBUS  (5 unrouted)